# Altium schematic sheet Sem 2 Lab Project - Simple Voice Recorder.SchDoc
size Letter; Date: 12/8/2021; DrawnBy: R.M.P.A.P. Rajapaksha; SheetNumber: 1; SheetTotal: 1; Project: SEM 2 - EN1093 - GROUP PROJECT; Sheet: Simple Voice Recorder; Group Number: 18; Sheet Number: 1; Total Sheet Number: 1; Sheet Size: A3; Time: 9:30:00 AM
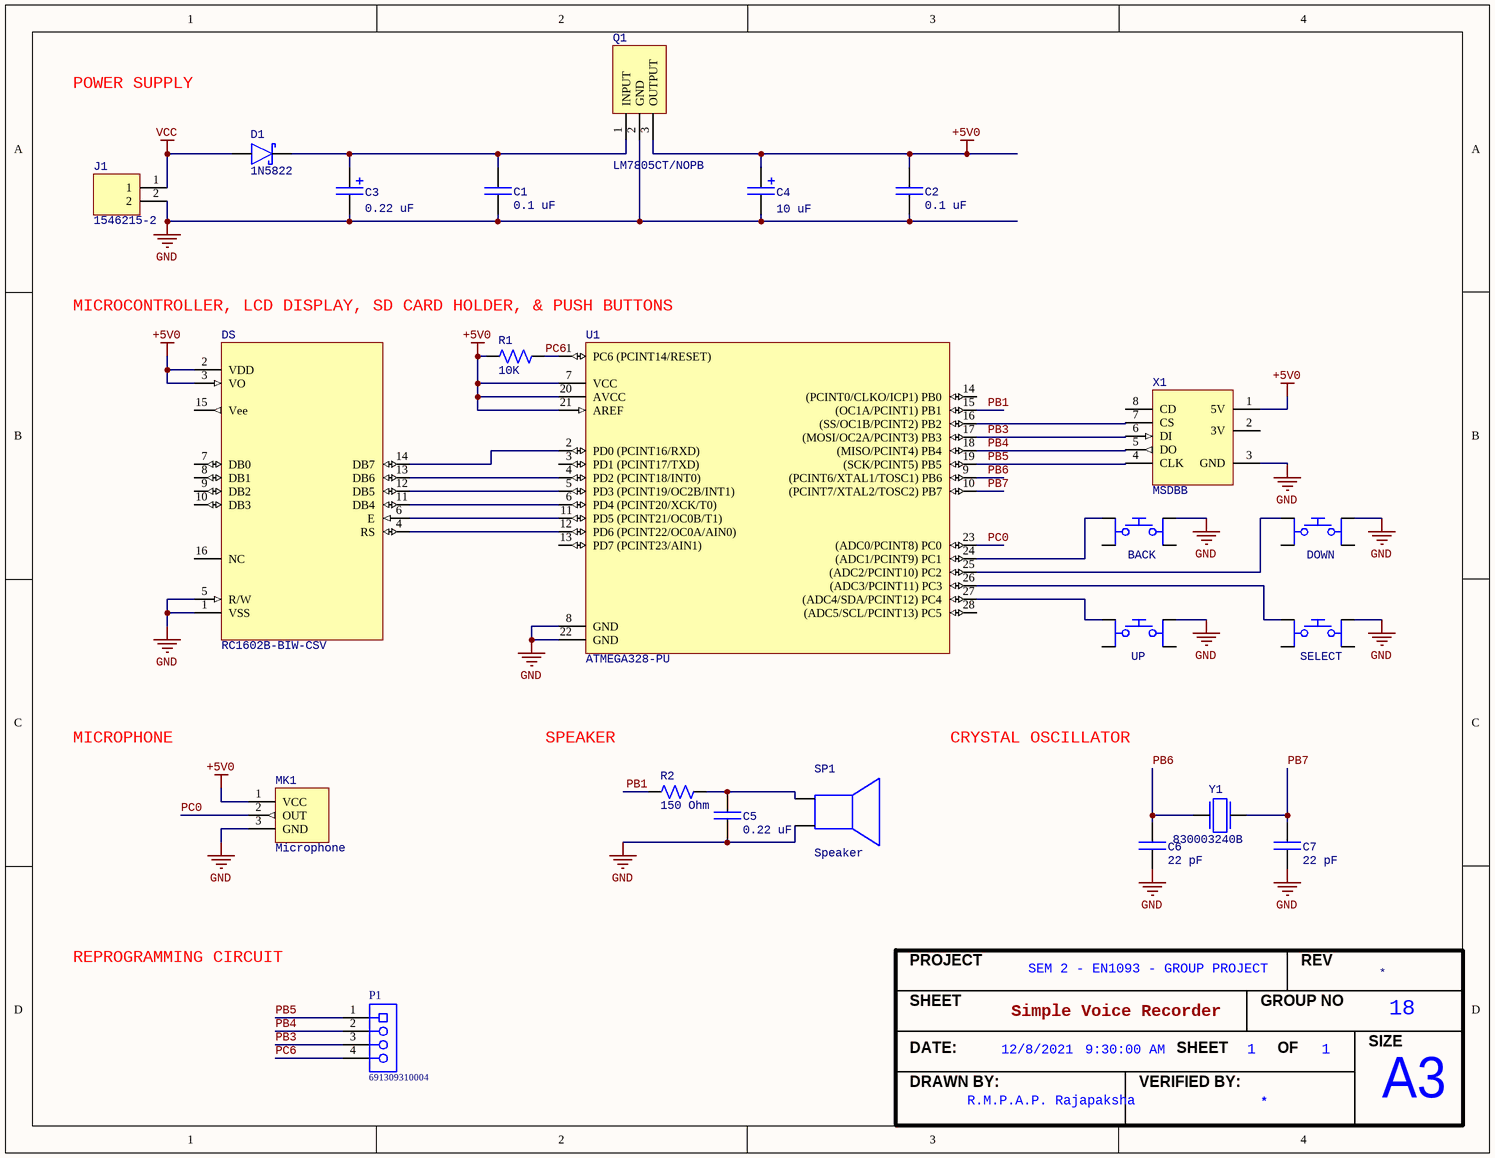
[diagram p0: Sem 2 Lab Project - Simple Voice Recorder.SchDoc]

## Parts
BACK  Push Button  [1825910-6]  (value not drawn)
C1  0.1 uF  [DE6E3KJ222MN3A]
C2  0.1 uF  [DE6E3KJ222MN3A]
C3  0.22 uF  [CAPPRD500W60D1000H1600-V-000-300]
C4  10 uF  [CAPPRD500W60D1000H1600-V-000-300]
C5  0.22 uF  [DE6E3KJ222MN3A]
C6  22 pF  [DE6E3KJ222MN3A]
C7  22 pF  [DE6E3KJ222MN3A]
D1  1N5822  [1N5822]
DOWN  Push Button  [1825910-6]  (value not drawn)
DS  RC1602B-BIW-CSV  [RC1602B-BIW-CSV]
J1  1546215-2  [1546215-2]
MK1  Microphone  [Adafruit Max4466]
P1  691309310004  [691309310004]
Q1  LM7805CT/NOPB  [LM7805CT/NOPB]
R1  10K  [RESAD800W55L650D230-100-300_SEI_CF14_CFM12]
R2  150 Ohm  [RESAD800W55L650D230-100-300_SEI_CF14_CFM12]
SELECT  Push Button  [1825910-6]  (value not drawn)
SP1  Speaker  [AST-01708MR-R]
U1  ATMEGA328-PU  [ATMEGA328-PU]
UP  Push Button  [1825910-6]  (value not drawn)
X1  MSDBB  [Micro SD Card Breakout Board]
Y1  830003240B  [830003240B]

## Nets
+5V0: C2.2 C4.1 DS.2(VDD) DS.3(VO) MK1.1(VCC) Q1.3(OUTPUT) R1.2 U1.7(VCC) U1.20(AVCC) U1.21(AREF) X1.1(5V)
GND: BACK.2 C1.1 C2.1 C3.2 C4.2 C5.1 C6.1 C7.1 DOWN.2 DS.1(VSS) DS.5(R/W) J1.2 MK1.3(GND) Q1.2(GND) SELECT.2 SP1.2 U1.8(GND) U1.22(GND) UP.2 X1.3(GND)
VCC: D1.A J1.1
PB1: R2.2 U1.15((OC1A/PCINT1)_PB1)
PB3: P1.3 U1.17((MOSI/OC2A/PCINT3)_PB3) X1.6(DI)
PB4: P1.2 U1.18((MISO/PCINT4)_PB4) X1.5(DO)
PB5: P1.1 U1.19((SCK/PCINT5)_PB5) X1.4(CLK)
PB6: C6.2 U1.9((PCINT6/XTAL1/TOSC1)_PB6) Y1.1
PB7: C7.2 U1.10((PCINT7/XTAL2/TOSC2)_PB7) Y1.2
PC0: MK1.2(OUT) U1.23((ADC0/PCINT8)_PC0)
PC6: P1.4 R1.1 U1.1(PC6_(PCINT14/RESET))
NetBACK_1: BACK.1 U1.24((ADC1/PCINT9)_PC1)
NetC1_2: C1.2 C3.1 D1.C Q1.1(INPUT)
NetC5_2: C5.2 R2.1 SP1.1
NetDOWN_1: DOWN.1 U1.25((ADC2/PCINT10)_PC2)
NetDS_4: DS.4(RS) U1.12(PD6_(PCINT22/OC0A/AIN0))
NetDS_6: DS.6(E) U1.11(PD5_(PCINT21/OC0B/T1))
NetDS_11: DS.11(DB4) U1.6(PD4_(PCINT20/XCK/T0))
NetDS_12: DS.12(DB5) U1.5(PD3_(PCINT19/OC2B/INT1))
NetDS_13: DS.13(DB6) U1.4(PD2_(PCINT18/INT0))
NetDS_14: DS.14(DB7) U1.2(PD0_(PCINT16/RXD))
NetSELECT_1: SELECT.1 U1.26((ADC3/PCINT11)_PC3)
NetU1_16: U1.16((SS/OC1B/PCINT2)_PB2) X1.7(CS)
NetU1_27: U1.27((ADC4/SDA/PCINT12)_PC4) UP.1

Not connected (* = marked no-connect by the designer): BACK 3 4; DOWN 3 4; DS 7(DB0) 8(DB1) 9(DB2) 10(DB3) 15(Vee) 16(NC); SELECT 3 4; U1 3(PD1_(PCINT17/TXD)) 13(PD7_(PCINT23/AIN1)) 14((PCINT0/CLKO/ICP1)_PB0) 28((ADC5/SCL/PCINT13)_PC5); UP 3 4; X1 2(3V) 8(CD)

## Notes on the sheet
- POWER SUPPLY
- MICROCONTROLLER, LCD DISPLAY, SD CARD HOLDER, & PUSH BUTTONS
- MICROPHONE
- SPEAKER
- CRYSTAL OSCILLATOR
- REPROGRAMMING CIRCUIT
- PROJECT
- REV
- SHEET
- GROUP NO
- SIZE
- DATE:
- DRAWN BY:
- VERIFIED BY:
- OF

## Library data of the parts
C1 C2 C5-C7 = Non-polarized Cap: Tolerance: *; Voltage Rating: *
  C1 C2: Value: 0.1 uF
  C5: Value: 0.22 uF
  C6 C7: Value: 22 pF
C3 C4 = Polarized Cap: Through Hole Capacitor, Polarized Radial Diameter; Tolerance: *; Voltage Rating: *
  C3: Value: 0.22 uF
  C4: Value: 10 uF
D1 = Schottky Diode: Diode Schottky 40V 3A Through Hole; ComponentLink1Description: Datasheet; ComponentLink1URL: https://www.snapeda.com/parts/1N5822/ON%20Semiconductor/datasheet/
DS = RC1602B-BIW-CSV: Display: LCD; alphanumeric; STN Negative; 16x2; blue; LED; PIN: 16; ComponentLink1Description: Datasheet; ComponentLink1URL: https://datasheetspdf.com/pdf/1111074/Raystar/RC1602B-BIW-CSV/1
J1 = Connection Terminal: TERMI-BLOK PCB MOUNT, 90 2P; ComponentLink1Description: Datasheet; ComponentLink1URL: https://www.snapeda.com/parts/1546215-2/TE%20Connectivity/datasheet/
P1 = CMP-1502-01849-1: Serie 3093 - 3.81mm Horizontal Reversed PCB Header WR-TBL, 4 pin; Manufacturer: Wurth Elektronik; Pin Number: 4; Gender: Female; Package Reference: 691309310004; Publisher: WurthElektronik; Datasheet URL: http://katalog.we-online.de/em/datasheet/6913093100xx.pdf; Manufacturer URL: http://www.we-online.de; Operating Temperature: -40to115degC; Pitch: 3.81mm; Mounting Technology: THT; Part Number: 691309310004; Packaging: Box
Q1 = Voltage Regulator: 1.5-A, 30-V, linear voltage regulator 3-TO-220 0 to 125; ComponentLink1Description: Datasheet; ComponentLink1URL: https://www.snapeda.com/parts/LM7805CT/NOPB/Texas%20Instruments/datasheet/
R1 R2 = Resistor: Power Rate: *; Tolerance: *
  R1: Value: 10K
  R2: Value: 150 Ohm
SP1 = Speaker: Manufacturer: PUI Audio Inc.; Impedance: 8 Ohm; Sensitivity: 90 dB; Power Rating: 0.2 W; ComponentLink1Description: Datasheet; ComponentLink1URL: https://www.snapeda.com/parts/AST-01708MR-R/PUI%20Audio/datasheet/
U1 = ATMEGA328-PU: AVR AVRÂ® ATmega Microcontroller IC 8-Bit 20MHz 32KB (16K x 16) FLASH 28-PDIP; Manufacturer: Microchip Technology Inc.; Value: *; Package: DIP-28; ComponentLink1Description: Datasheet; ComponentLink1URL: https://ww1.microchip.com/downloads/en/DeviceDoc/ATmega48A-PA-88A-PA-168A-PA-328-P-DS-DS40002061B.pdf
X1 = Micro SD Card Breakout Board: Manufacturer: Adafruit Industries; Value: *; Package: *; ComponentLink1Description: Datasheet; ComponentLink1URL: *; ComponentLink2Description: Tutorial; ComponentLink2URL: https://learn.adafruit.com/adafruit-micro-sd-breakout-board-card-tutorial
Y1 = 830003240B: Crystal Oscillator; Frequency: 16MHz; ComponentLink1Description: Datasheet; ComponentLink1URL: https://www.mouser.com/datasheet/2/445/830003240B-2005173.pdf
BACK DOWN SELECT UP = Push Button: Value: *; ComponentLink1Description: Datasheet; ComponentLink1URL: https://www.snapeda.com/parts/1825910-6/TE%20Connectivity/datasheet/
MK1 = Microphone: Reference: https://www.adafruit.com/product/1063